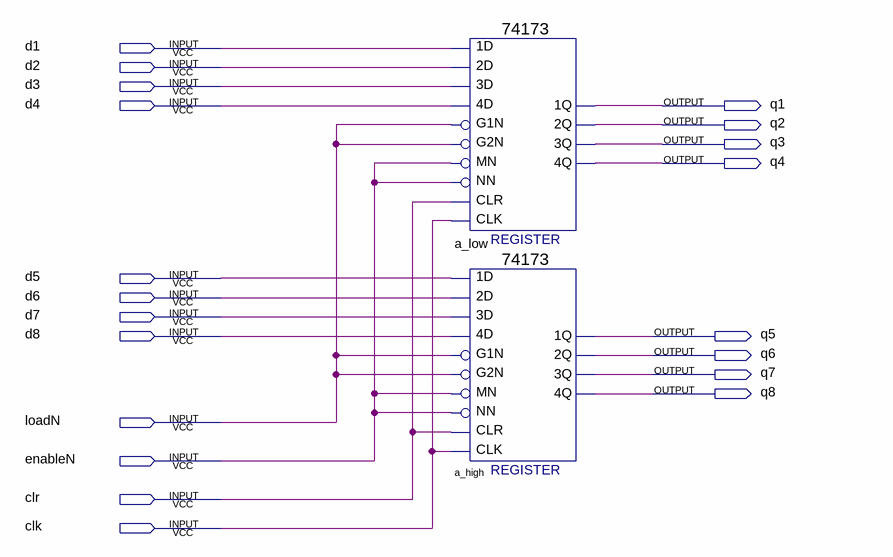
[diagram p0: schematic sheet]
// Quartus schematic 8bitreg.bdf as structural Verilog: 2 symbols, 20 pins
module \8bitreg  (
  input  d1,
  input  d2,
  input  d3,
  input  d4,
  input  d5,
  input  d6,
  input  d7,
  input  d8,
  input  loadN,
  input  enableN,
  input  clr,
  input  clk,
  output q1,
  output q2,
  output q3,
  output q4,
  output q5,
  output q6,
  output q7,
  output q8
);

  \74173  a_low (
    .\3D (d3), .MN(enableN), .\1D (d1), .\2D (d2), .\4D (d4), .G1N(loadN), .G2N(loadN), .NN(enableN),
    .CLR(clr), .CLK(clk), .\3Q (q3), .\2Q (q2), .\1Q (q1), .\4Q (q4));
  \74173  a_high (
    .\3D (d7), .MN(enableN), .\1D (d5), .\2D (d6), .\4D (d8), .G1N(loadN), .G2N(loadN), .NN(enableN),
    .CLR(clr), .CLK(clk), .\3Q (q7), .\2Q (q6), .\1Q (q5), .\4Q (q8));
endmodule
